# Altium schematic sheet USB_UART_IMU.SchDoc
size A4; Date: 27.05.2014; Author: AOM1; DrawnBy: AOM1; Organization: BFH; Address1: Berner Fachhochschule; Address2: Technik und Informatik; Address3: Jlcoweg 1; Address4: 3400 Burgdorf; DocumentNumber: 1; Revision: 1.0; SheetNumber: 2; SheetTotal: 6; CurrentDate: 27.05.2014
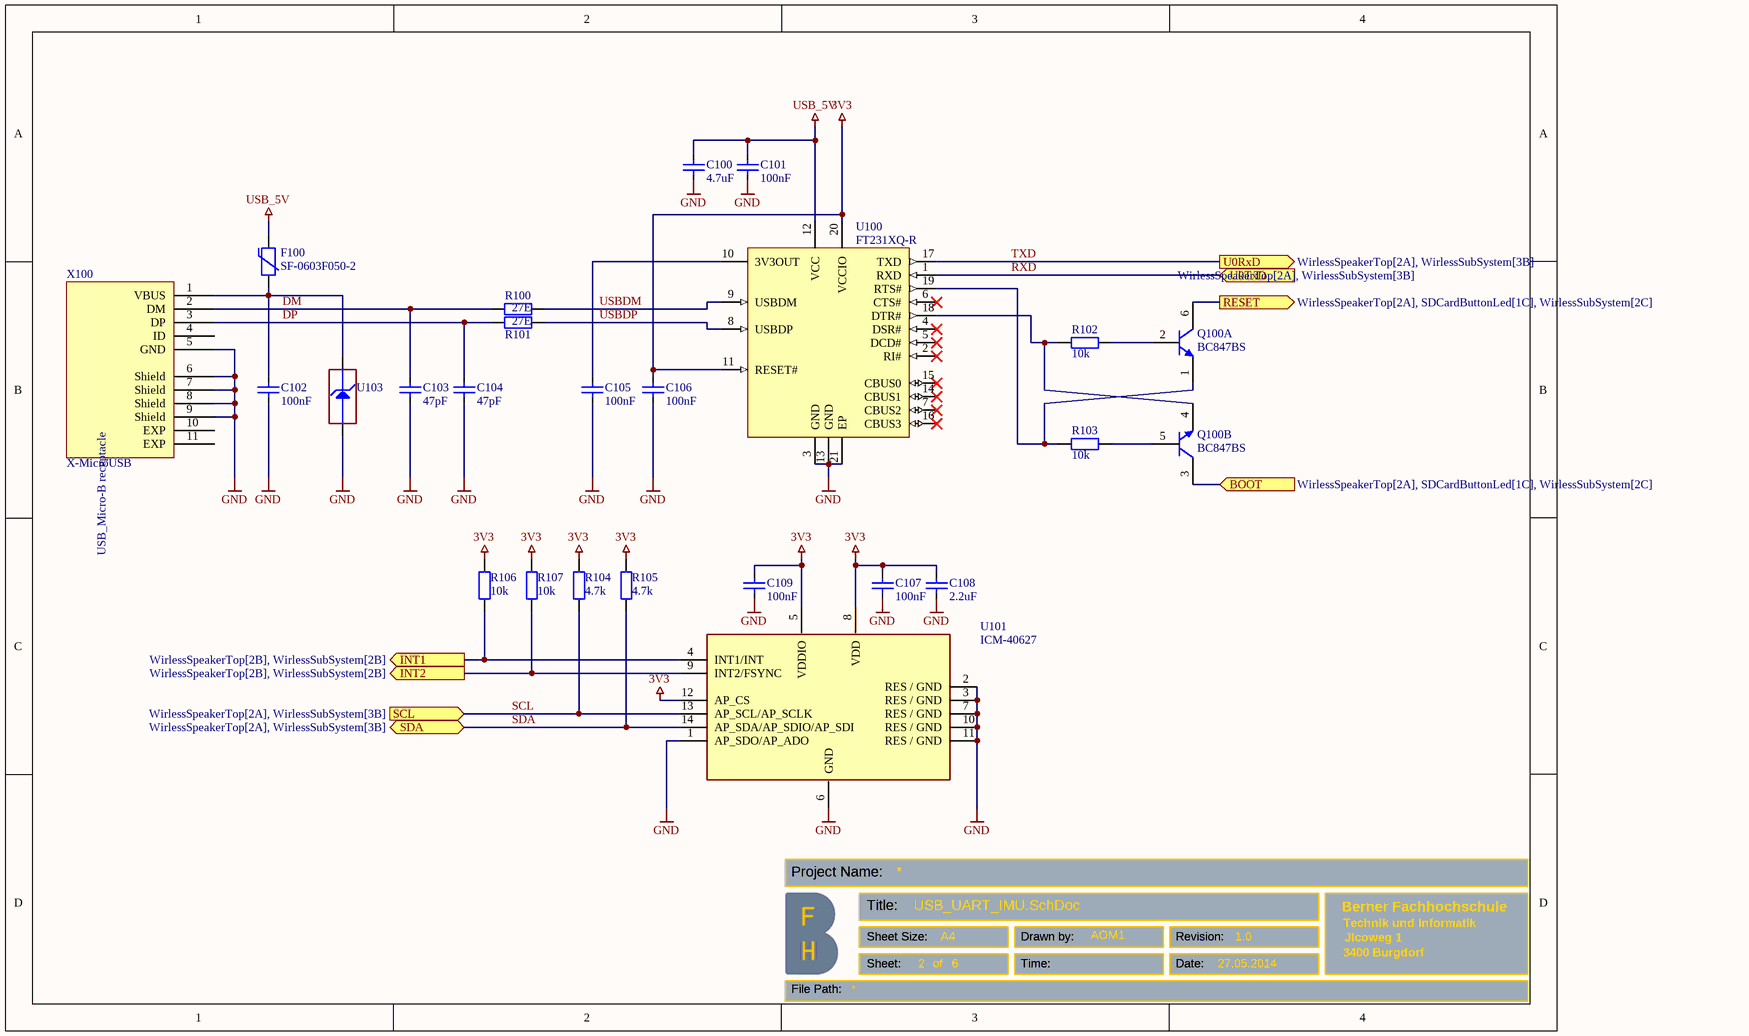
[diagram p0: USB_UART_IMU.SchDoc]

## Parts
C100  4.7uF  [C-0603]
C101  100nF  [C-0603]
C102  100nF  [C-0603]
C103  47pF  [C-0603]
C104  47pF  [C-0603]
C105  100nF  [C-0603]
C106  100nF  [C-0603]
C107  100nF  [C-0603]
C108  2.2uF  [C-0603]
C109  100nF  [C-0603]
F100  SF-0603F050-2  [SMD-0603]
Q100  BC847BS  [SOT-23-6]  (parts A,B of 2)
R100  27E  [R-0603]
R101  27E  [R-0603]
R102  10k  [R-0603]
R103  10k  [R-0603]
R104  4.7k  [R-0603]
R105  4.7k  [R-0603]
R106  10k  [R-0603]
R107  10k  [R-0603]
U100  FT231XQ-R  [QFN-20-M]
U101  ICM-40627  [LGA-14]
U103  ESDA7P120-1U1M  [ESD_QFN1610_2N_1K_2A]  (value not drawn)
X100  X-MicroUSB  [Micro-USB]

## Ports
BOOT (in, see WirlessSpeakerTop[2A], SDCardButtonLed[1C], WirlessSubSystem[2C]), INT1 (out, see WirlessSpeakerTop[2B], WirlessSubSystem[2B]), INT2 (out, see WirlessSpeakerTop[2B], WirlessSubSystem[2B]), RESET (out, see WirlessSpeakerTop[2A], SDCardButtonLed[1C], WirlessSubSystem[2C]), SCL (in, see WirlessSpeakerTop[2A], WirlessSubSystem[3B]), SDA (bidir, see WirlessSpeakerTop[2A], WirlessSubSystem[3B]), U0RxD (out, see WirlessSpeakerTop[2A], WirlessSubSystem[3B]), U0TxD (in, see WirlessSpeakerTop[2A], WirlessSubSystem[3B])

## Nets
3V3: C106.2 C107.2 C108.2 C109.2 R104.2 R105.2 R106.2 R107.2 U100.11(RESET#) U100.20(VCCIO) U101.5(VDDIO) U101.8(VDD) U101.12(AP_CS)
GND: C100.1 C101.1 C102.1 C103.1 C104.1 C105.1 C106.1 C107.1 C108.1 C109.1 U100.3(GND) U100.13(GND) U100.21(EP) U101.1(AP_SDO/AP_ADO) U101.2(RES_/_GND) U101.3(RES_/_GND) U101.6(GND) U101.7(RES_/_GND) U101.10(RES_/_GND) U101.11(RES_/_GND) U103.2(GND) X100.5(GND) X100.6(Shield) X100.7(Shield) X100.8(Shield) X100.9(Shield)
USB_5V: C100.2 C101.2 F100.2 U100.12(VCC)
BOOT: Q100.3(C2) ; port BOOT
DM: C103.2 R100.1 X100.2(DM)
DP: C104.2 R101.1 X100.3(DP)
INT1: R106.1 U101.4(INT1/INT) ; port INT1
INT2: R107.1 U101.9(INT2/FSYNC) ; port INT2
RESET: Q100.6(C1) ; port RESET
RXD: U100.1(RXD) ; port U0TxD
SCL: R104.1 U101.13(AP_SCL/AP_SCLK) ; port SCL
SDA: R105.1 U101.14(AP_SDA/AP_SDIO/AP_SDI) ; port SDA
TXD: U100.17(TXD) ; port U0RxD
USBDM: R100.2 U100.9(USBDM)
USBDP: R101.2 U100.8(USBDP)
NetC102_2: C102.2 F100.1 U103.1(IO1) X100.1(VBUS)
NetC105_2: C105.2 U100.10(3V3OUT)
NetQ100_1: Q100.1(E1) R103.1 U100.19(RTS#)
NetQ100_2: Q100.2(B1) R102.2
NetQ100_4: Q100.4(E2) R102.1 U100.18(DTR#)
NetQ100_5: Q100.5(B2) R103.2

Not connected (* = marked no-connect by the designer): U100 2(RI#)* 4(DSR#)* 5(DCD#)* 6(CTS#)* 7(CBUS2)* 14(CBUS1)* 15(CBUS0)* 16(CBUS3)*; X100 4(ID) 10(EXP) 11(EXP)

## Notes on the sheet
- Project Name:
- Title:
- Sheet Size:
- Sheet:
- of
- A4
- Drawn by:
- Time:
- Revision:
- Date:
- File Path:
- (in symbol X-MicroUSB) USB_Micro-B receptacle

## Library data of the parts
C100-C109 = C-SMD-0603: Multilayer Ceramic Capacitors MLCC; Manufacturer: Murata Electronics; Mfr. Part No.: GRM18...; Order-Code: 81-GRM18...; Price (CHF): 0.12; Distributor: Mouser; Added: 28.08.2018; ComponentLink1Description: Chip Multilayer Ceramic Capacitors; ComponentLink1URL: https://www.mouser.ch/datasheet/2/281/murata_03052018_GRM_Series_1-1310166.pdf; Notice: -; Mounting Style: SMD/SMT; Package: 0603
F100 = F-0603F050-2: Surface Mount Fuses 0.5A Fast Acting; Manufacturer: Bourns; Order-Code: 652-SF-0603F050-2; Distributor: Mouser; Added: 02.02.2017; Price (CHF): 0.542; Mfr. Part No.: SF-0603F050-2; ComponentLink1Description: Mouser Datasheet; ComponentLink1URL: https://www.mouser.ch/datasheet/2/54/f0603f-778085.pdf; Package: 0603; Notice: -; Mounting Style: SMD/SMT
Q100 = Q-BC847BS: Bipolares Transistor-Array, Universal, NPN, 45 V, 250 mW, 100 mA, 200 hFE, SC-88; Manufacturer: Diodes Incorporated; Mfr. Part No.: BC847BS-7-F; Order-Code: 621-BC847BS-7-F; Distributor: Mouser; Price (CHF): 0.23; Added: 28.08.2018; ComponentLink1Description: DUAL NPN SMALL SIGNAL SURFACE MOUNT TRANSISTOR; ComponentLink1URL: https://www.mouser.ch/datasheet/2/115/ds30222-71055.pdf; Package: SOT-23-6; Notice: -; Mounting Style: SMD/SMT
R100-R107 = R-SMD-0603: Thin Film Resistors - SMD  0.1W  1%; Mfr. Part No.: MCU08050C*; Manufacturer: Vishay / Beyschlag; Order-Code: BFH-Lager; Price (CHF): 0.1; Distributor: Mouser; Notice: -; Added: 10.11.2012; Mounting Style: SMD/SMT; Package: 0603
U100 = U-FT231XQ-R: USB Interface IC USB to Full Serial UART; Order-Code: 895-FT231XQ-R; PackageVersion: Feb-2012; ComponentLink2Description: Datasheet; Code_JEDEC: MO-220WGGD-1; DatasheetVersion: ver 1.0, Feb-2012; ComponentLink2URL: http://www.ftdichip.com/Support/Documents/DataSheets/ICs/DS_FT231X.pdf; ComponentLink1Description: Manufacturer URL; ComponentLink3Description: FT231X Product Page; PackageReference: QFN-20; ComponentLink3URL: www.ftdichip.com/Products/ICs/FT231X.html; ComponentLink1URL: http://www.ftdichip.com/; PackageDescription: 20-Pin Quad Flat No-Lead, 4 x 4 mm Body, 0.5 mm Pitch; Added: 10.08.2021; Distributor: Mouser; Notice: -; Package: QFN-20; Mounting Style: SMD/SMT; Mfr. Part No.: FT231XQ-R
U101 = U-ICM-40627: IMUs - Inertial Measurement Units Highly accurate MEMS based motion sensor; Manufacturer: TDK InvenSense; Order-Code: 410-ICM-40627; Mfr. Part No.: ICM-40627; Distributor: Mouser; Price (CHF): 3.58; Added: 06.08.2021; Mounting Style: SMD/SMT; Package: LGA-14; Notice: -
U103 = U-ESDA7P120-1U1M: 5V High power transient voltage suppressor; Manufacturer: STMicroelectronics; Order-Code: 511-ESDA7P120-1U1M; Distributor: Mouser; Price (CHF): 0.139; Added: 07.08.2021; Mfr. Part No.: ESDA7P120-1U1M; Package: ESD_QFN1610_2N_1K_2A; Mounting Style: SMD; Notice: -
X100 = X-MicroUSB: USB-Stecker MICRO USB B; Manufacturer: Molex; Mfr. Part No.: 105017-0001; Order-Code: 538-105017-0001; Distributor: Mouser; Price (CHF): 0.523; Value: *; Package: MicroUSB; Mounting Style: SMD/SMT; Added: 10.08.2021; Notice: *